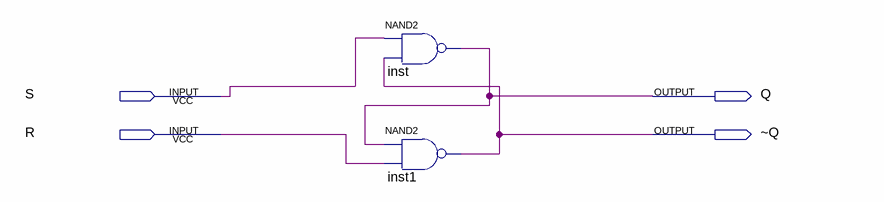
[diagram p0: schematic sheet]
// Quartus schematic lab9step1.bdf as structural Verilog: 2 symbols, 4 pins
module lab9step1 (
  input  S,
  input  R,
  output Q,
  output \~Q 
);

  nand inst (Q, S, \~Q );
  nand inst1 (\~Q , Q, R);
endmodule
